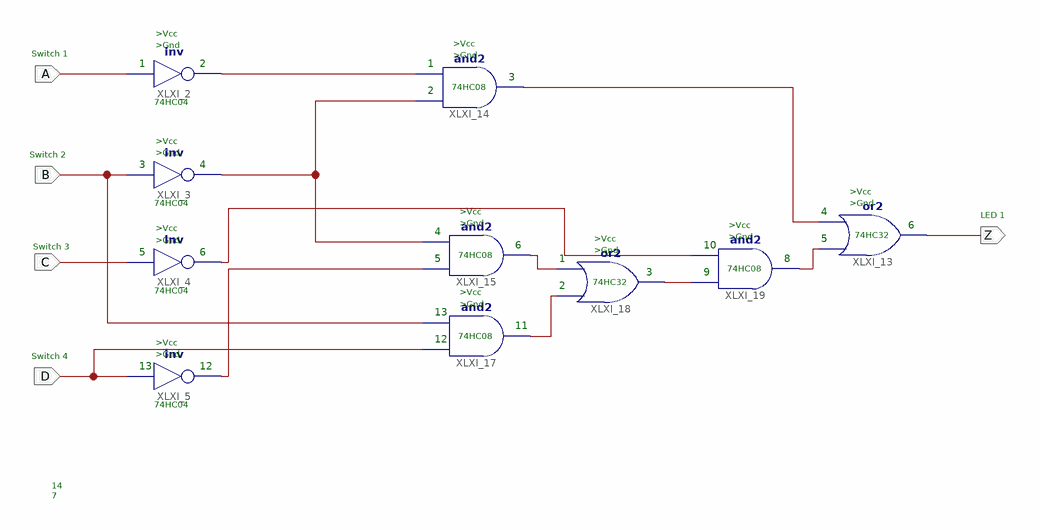
[diagram p0: schematic sheet 1]
// Xilinx ISE schematic p1ej2a.sch (spartan3) as structural Verilog: 10 symbols, 5 ports
module p1ej2a (
  input  A,
  input  B,
  input  C,
  input  D,
  output Z
);

  wire XLXN_10, XLXN_20, XLXN_21, XLXN_22, XLXN_25, XLXN_26, XLXN_27, XLXN_28, XLXN_30;

  not XLXI_2 (XLXN_10, A);
  not XLXI_3 (XLXN_20, B);
  not XLXI_4 (XLXN_26, C);
  not XLXI_5 (XLXN_30, D);
  or XLXI_13 (Z, XLXN_27, XLXN_28);
  and XLXI_14 (XLXN_28, XLXN_20, XLXN_10);
  and XLXI_15 (XLXN_25, XLXN_30, XLXN_20);
  and XLXI_17 (XLXN_22, D, B);
  or XLXI_18 (XLXN_21, XLXN_22, XLXN_25);
  and XLXI_19 (XLXN_27, XLXN_21, XLXN_26);

  // Notes on the sheet:
  //   >Vcc
  //   >Vcc
  //   >Gnd
  //   Switch 1
  //   >Gnd
  //   1
  //   2
  //   1
  //   3
  //   74HC08
  //   2
  //   74HC04
  //   >Vcc
  //   >Gnd
  //   Switch 2
  //   3
  //   4
  //   >Vcc
  //   74HC04
  //   >Gnd
  //   >Vcc
  //   4
  //   LED 1
  //   >Gnd
  //   >Vcc
  //   6
  //   >Vcc
  //   4
  //   74HC32
  //   >Gnd
  //   >Vcc
  //   5
  //   >Gnd
  //   6
  //   10
  //   Switch 3
  //   >Gnd
  //   5
  //   6
  //   74HC08
  //   5
  //   1
  //   8
  //   74HC08
  //   3
  //   9
  //   74HC32
  //   2
  //   74HC04
  //   >Vcc
  //   >Gnd
  //   13
  //   11
  //   74HC08
  //   12
  //   >Vcc
  //   >Gnd
  //   Switch 4
  //   13
  //   12
  //   74HC04
  //   14
  //   7
endmodule
